# EAGLE design Arturo_Verasv22 (EAGLE 8.7.1)
Circuito Anti-jammer
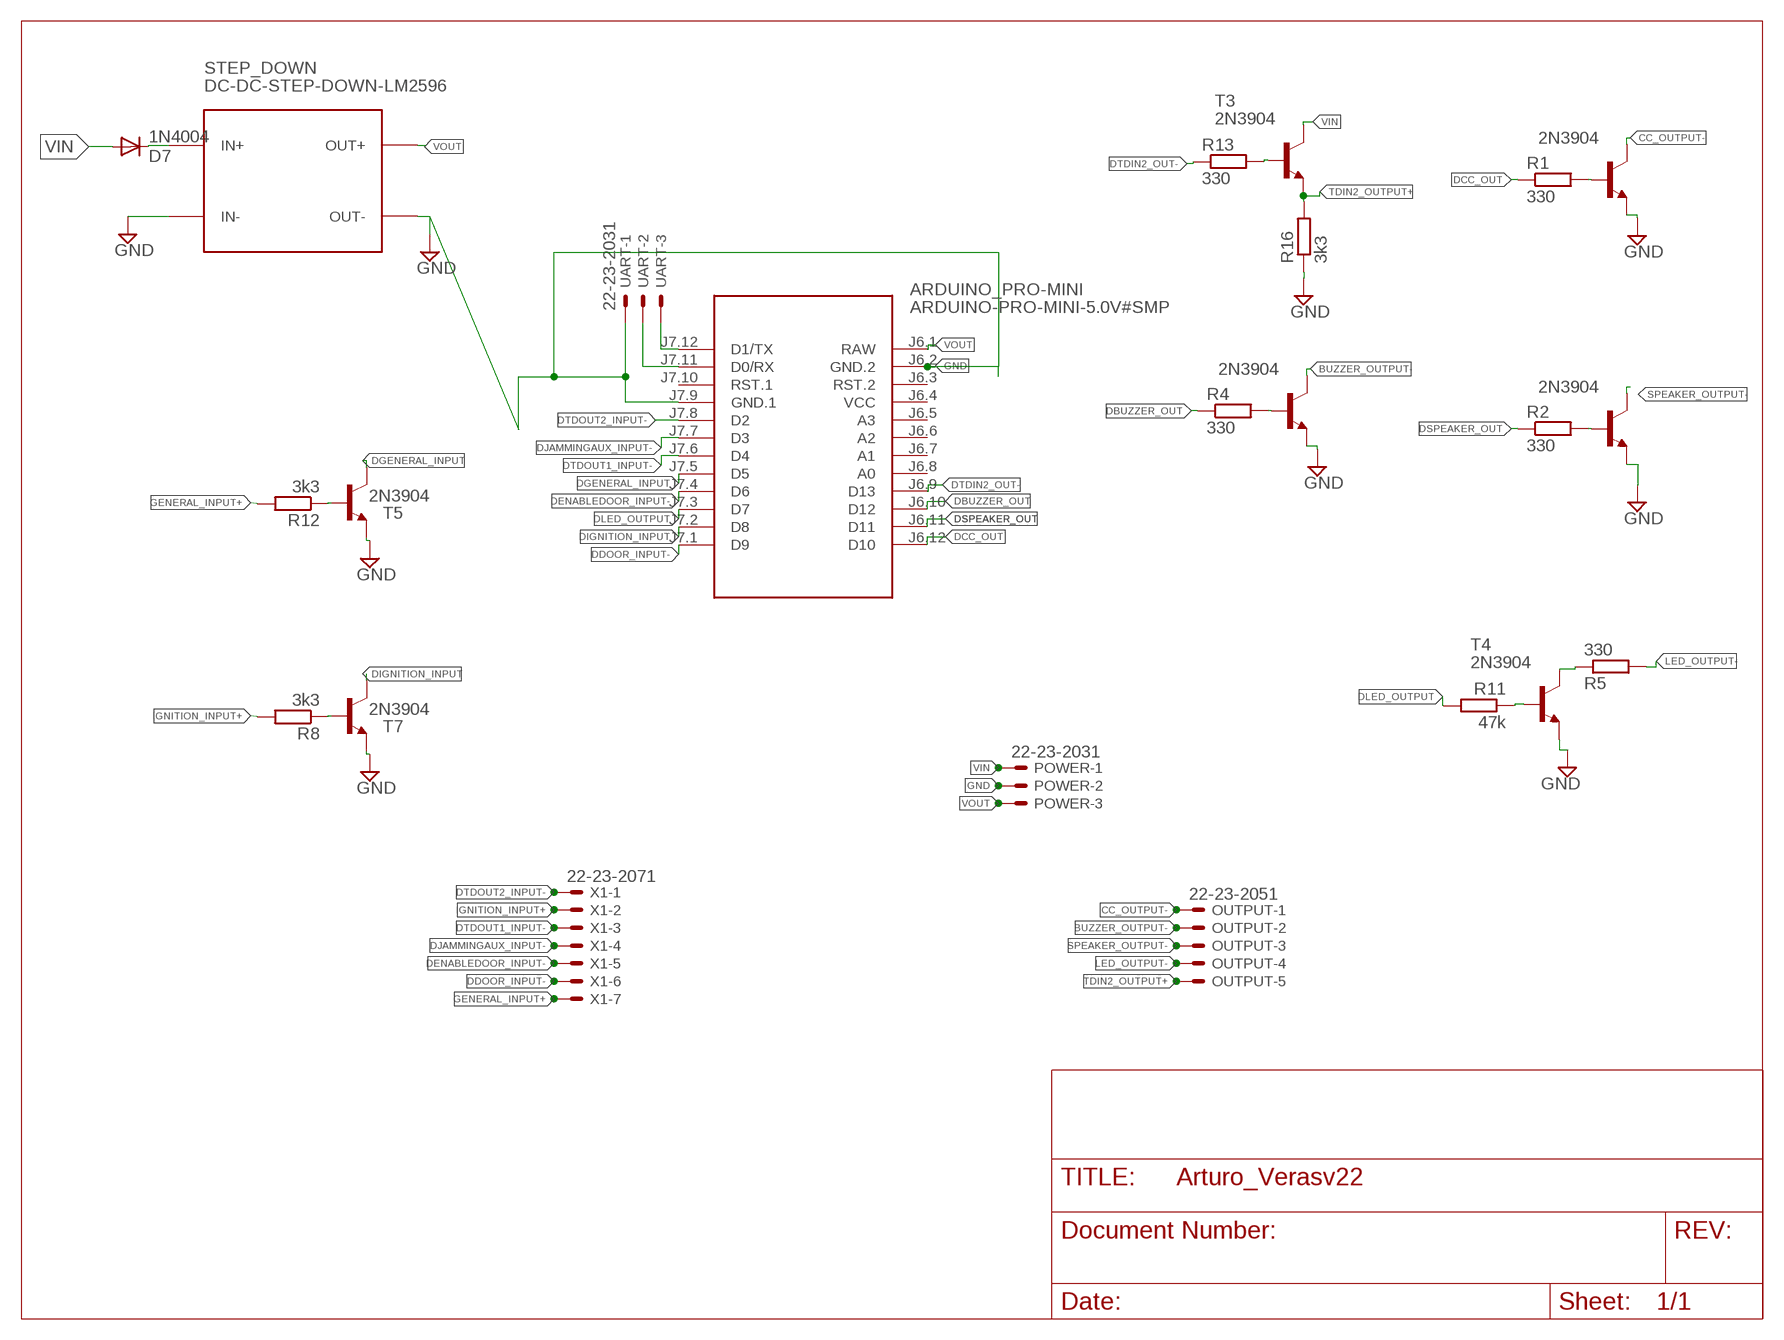
[diagram p0: schematic, sheet 1]

## Parts
ARDUINO_PRO-MINI  ARDUINO-PRO-MINI-5.0V#SMP  [ARDUINO-PRO-MINI#SMP]
D7  1N4004  [DO41-10]
OUTPUT  22-23-2051  [22-23-2051]
POWER  22-23-2031  [22-23-2031]
R1  330  R-EU_0204/7  [0204/7]
R2  330  R-EU_0204/7  [0204/7]
R4  330  R-EU_0204/7  [0204/7]
R5  330  R-EU_0204/7  [0204/7]
R8  3k3  R-EU_0204/7  [0204/7]
R11  47k  R-EU_0204/7  [0204/7]
R12  3k3  R-EU_0204/7  [0204/7]
R13  330  R-EU_0204/7  [0204/7]
R16  3k3  R-EU_0204/7  [0204/7]
STEP_DOWN  DC-DC-STEP-DOWN-LM2596  [DC-DC-STEP-DOWN-LM2596]
T1  2N3904  [TO92]
T3  2N3904  [TO92]
T4  2N3904  [TO92]
T5  2N3904  [TO92]
T6  2N3904  [TO92]
T7  2N3904  [TO92]
T8  2N3904  [TO92]
UART  22-23-2031  [22-23-2031]
X1  22-23-2071  [22-23-2071]

## Nets
BUZZER_OUTPUT-: OUTPUT.2 T6.1(C)
CC_OUTPUT-: OUTPUT.1 T8.1(C)
DBUZZER_OUT: ARDUINO_PRO-MINI.J6.10(D12) R4.1
DCC_OUT: ARDUINO_PRO-MINI.J6.12(D10) R1.1
DDOOR_INPUT-: ARDUINO_PRO-MINI.J7.1(D9) X1.6
DENABLEDOOR_INPUT-: ARDUINO_PRO-MINI.J7.4(D6) X1.5
DGENERAL_INPUT: ARDUINO_PRO-MINI.J7.5(D5) T5.1(C)
DIGNITION_INPUT: ARDUINO_PRO-MINI.J7.2(D8) T7.1(C)
DJAMMINGAUX_INPUT-: ARDUINO_PRO-MINI.J7.7(D3) X1.4
DLED_OUTPUT: ARDUINO_PRO-MINI.J7.3(D7) R11.2
DSPEAKER_OUT: ARDUINO_PRO-MINI.J6.11(D11) R2.1
DTDIN2_OUT-: ARDUINO_PRO-MINI.J6.9(D13) R13.1
DTDOUT1_INPUT-: ARDUINO_PRO-MINI.J7.6(D4) X1.3
DTDOUT2_INPUT-: ARDUINO_PRO-MINI.J7.8(D2) X1.1
GENERAL_INPUT+: R12.2 X1.7
GND: ARDUINO_PRO-MINI.J6.2(GND.2) ARDUINO_PRO-MINI.J7.9(GND.1) POWER.2 R16.1 STEP_DOWN.IN- STEP_DOWN.OUT- T1.3(E) T4.3(E) T5.3(E) T6.3(E) T7.3(E) T8.3(E) UART.1
IGNITION_INPUT+: R8.2 X1.2
LED_OUTPUT-: OUTPUT.4 R5.2
N$1: R12.1 T5.2(B)
N$2: R13.2 T3.2(B)
N$3: R1.2 T8.2(B)
N$4: R2.2 T1.2(B)
N$5: R4.2 T6.2(B)
N$6: R5.1 T4.1(C)
N$7: ARDUINO_PRO-MINI.J7.12(D1/TX) UART.3
N$8: ARDUINO_PRO-MINI.J7.11(D0/RX) UART.2
N$20: R11.1 T4.2(B)
N$22: R8.1 T7.2(B)
N$23: D7.C STEP_DOWN.IN+
SPEAKER_OUTPUT-: OUTPUT.3 T1.1(C)
TDIN2_OUTPUT+: OUTPUT.5 R16.2 T3.3(E)
VIN: D7.A POWER.1 T3.1(C)
VOUT: ARDUINO_PRO-MINI.J6.1(RAW) POWER.3 STEP_DOWN.OUT+
Unconnected: ARDUINO_PRO-MINI.J6.3(RST.2) ARDUINO_PRO-MINI.J6.5(A3) ARDUINO_PRO-MINI.J6.6(A2) ARDUINO_PRO-MINI.J6.7(A1) ARDUINO_PRO-MINI.J6.8(A0) ARDUINO_PRO-MINI.J7.10(RST.1)

## Power pins joined to a net without a drawn wire
VOUT: ARDUINO_PRO-MINI.J6.4(VCC)

## Library data of the parts
ARDUINO_PRO-MINI = diy-modules:ARDUINO-PRO-MINI-*#SMP: Arduino Pro Mini (and compatible devices) with 2 connectors only More details available here: https://www.arduino.cc/en/Main/ArduinoBoardProMini Click here to find device on ebay.com <http://www.ebay.com/sch/arduino+pro+mini>
D7 = diode:1N4004: DIODE general purpose rectifier, 1 A
OUTPUT = con-molex:22-23-2051: .100" (2.54mm) Center Header - 5 Pin; MF: MOLEX; MPN: 22-23-2051; OC_FARNELL: 1462952; OC_NEWARK: 38C9178
POWER UART = con-molex:22-23-2031: .100" (2.54mm) Center Header - 3 Pin; MF: MOLEX; MPN: 22-23-2031; OC_FARNELL: 1462950; OC_NEWARK: 30C0862
R1 R2 R4 R5 R8 R11-R13 R16 = resistor:R-EU_: RESISTOR, European symbol
STEP_DOWN = diy-modules:DC-DC-STEP-DOWN-LM2596: DC/DC Step-Down Regulator based on LM2596-ADJ chip LM2596 datasheet available here: http://www.ti.com/lit/ds/symlink/lm2596.pdf Click here to find device on ebay.com <http://www.ebay.com/sch/lm2596+power+regulator>
T1 T3-T8 = transistor:2N3904: NPN TRANSISTOR
X1 = con-molex:22-23-2071: .100" (2.54mm) Center Header - 7 Pin; MF: MOLEX; MPN: 22-23-2071; OC_FARNELL: 1654534; OC_NEWARK: 56H0445

## Board
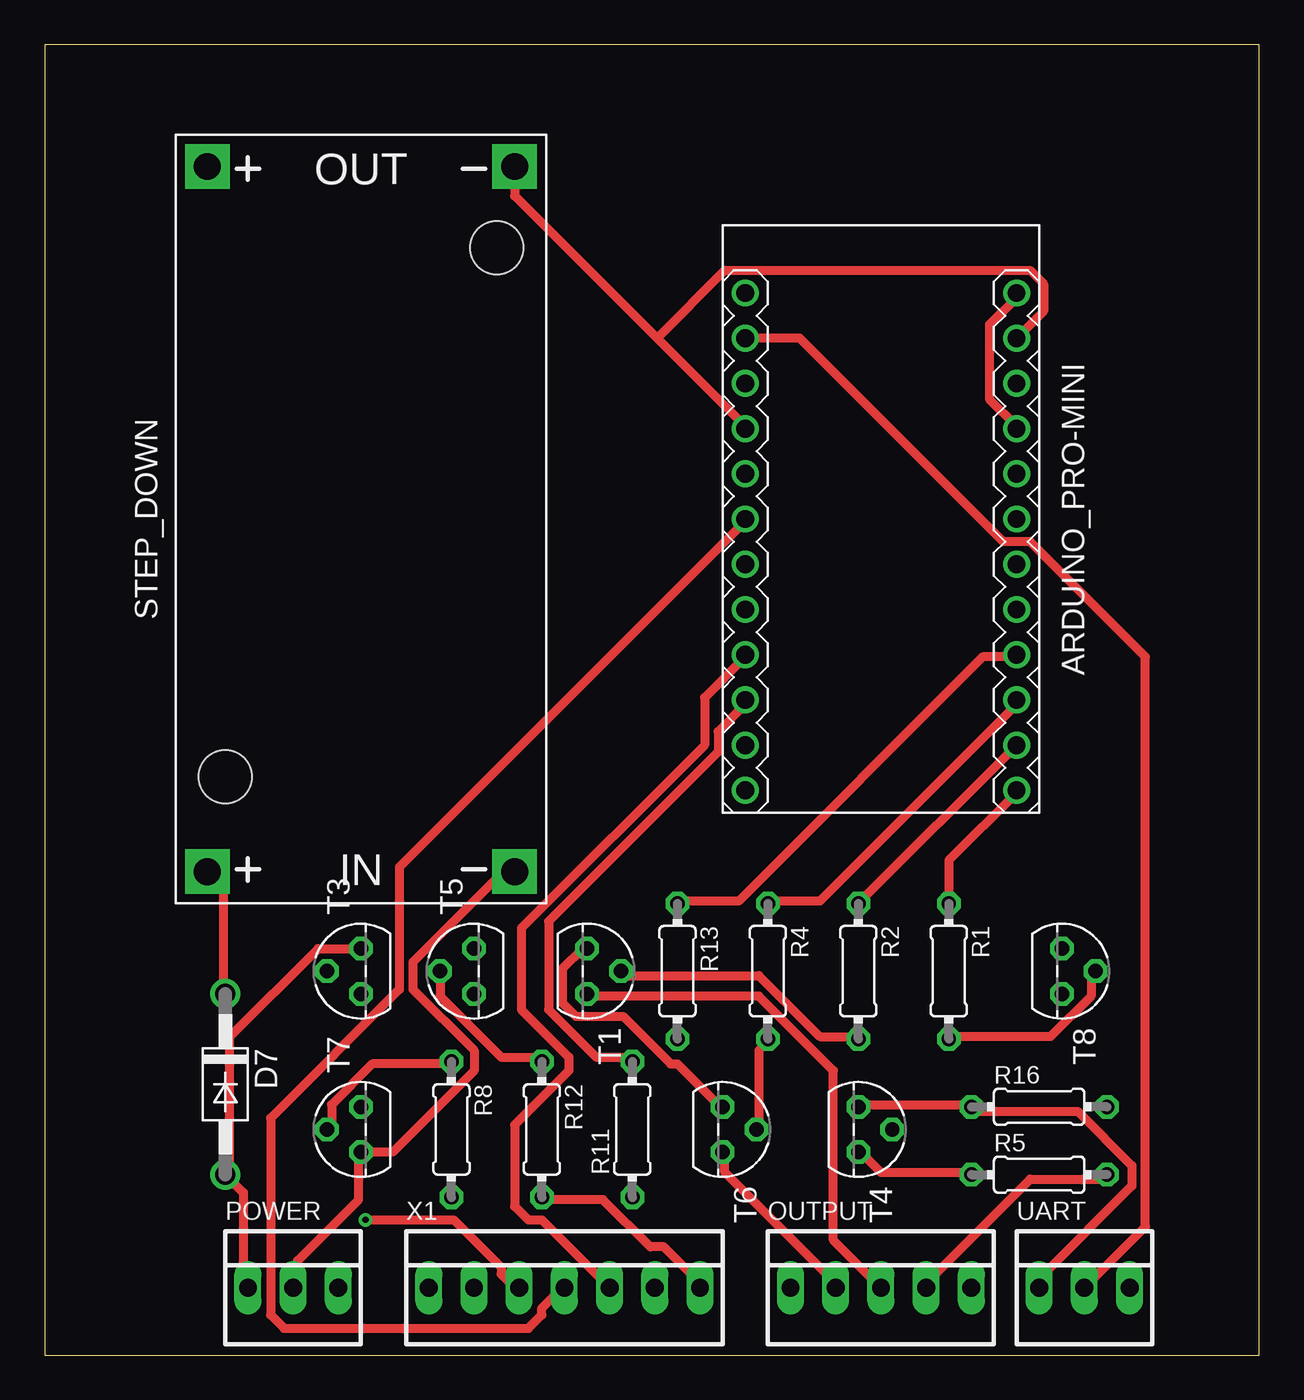
[diagram p1: board, top side]
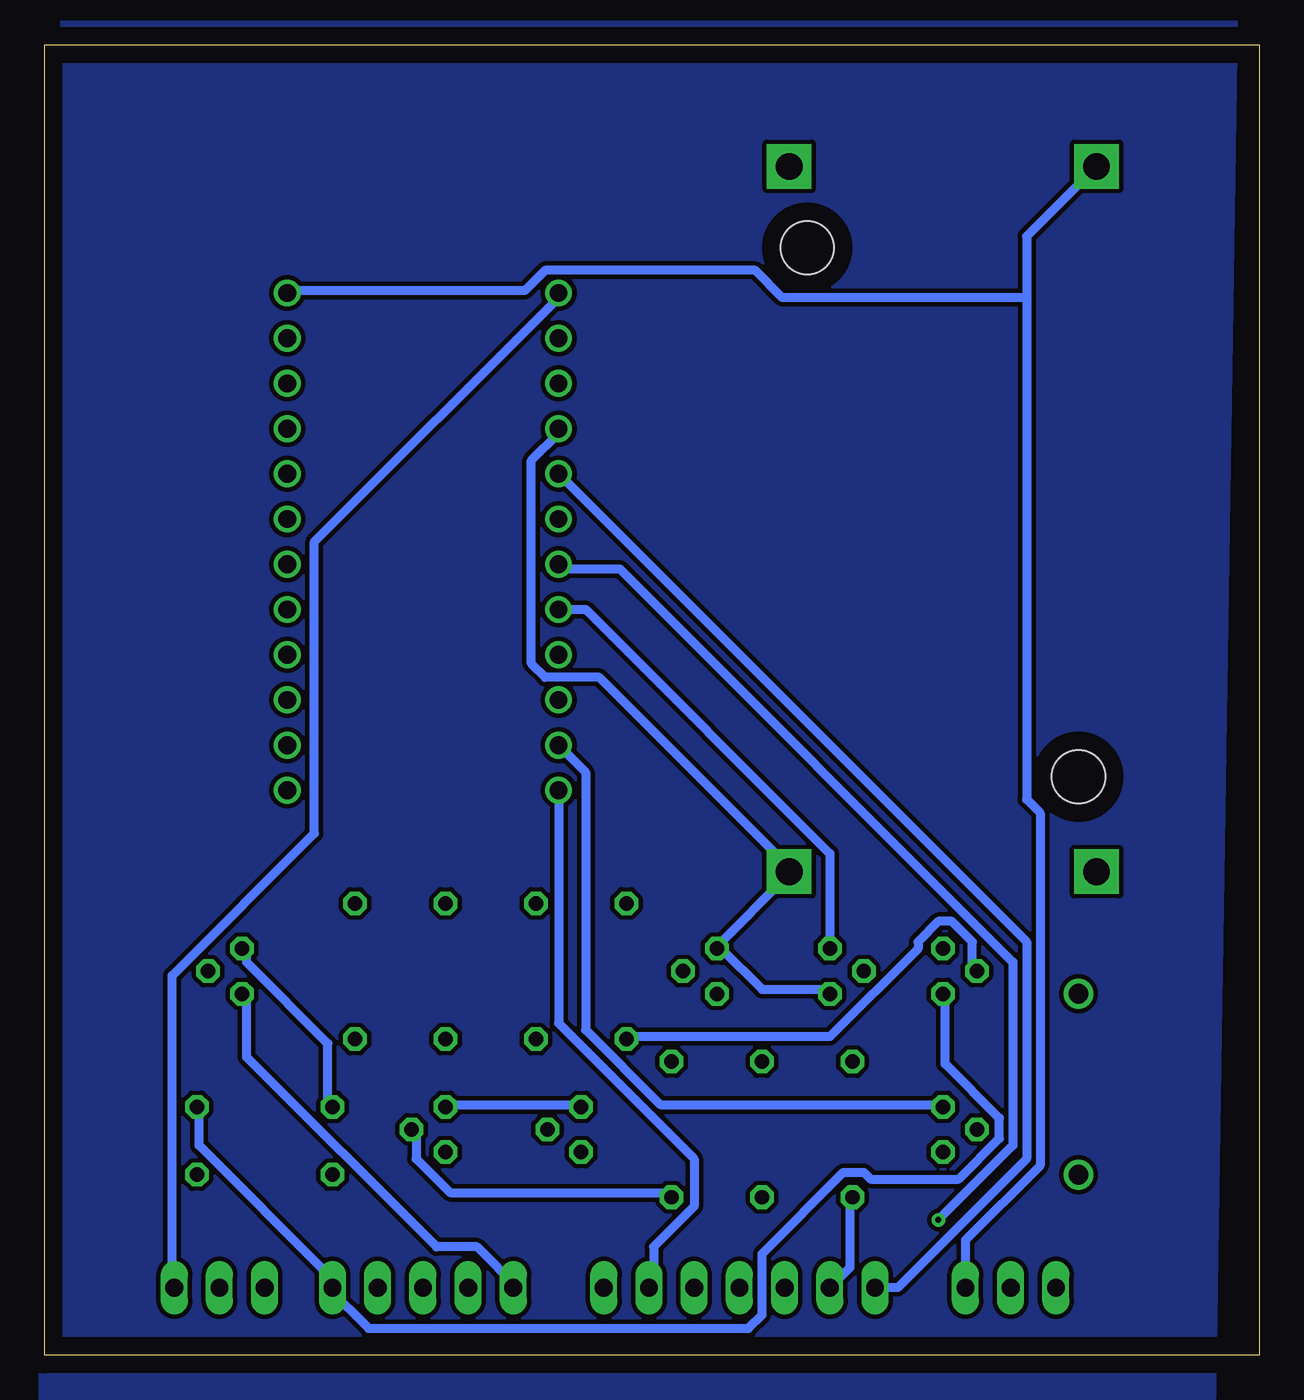
[diagram p2: board, bottom side, seen from below]

Size 68.25 x 73.65 mm. Coordinates in mm from the lower left corner, seen from the top.
Outline: 0,0 68.25,0 68.25,73.65 0,73.65 0,0
Copper layers (1*16): Top 0.035mm / dielectric 1.5mm / Bottom 0.035mm
Design rules "default *": minimum track width 20mil, minimum drill 0.35mm, track to track 10mil, track to pad 10mil, pad to pad 6mil, via to via 10mil, smd to smd 6mil, copper to edge 40mil, drill to drill 6mil, minimum pad ring 10mil, minimum via ring 8mil, stop-mask expansion 4mil, vias tented up to drill 0mil, thermal gap 10mil

### Footprints (pad centres in the part's own frame; a part is rotated, then mirrored left to right if it is on the bottom)
ARDUINO-PRO-MINI#SMP = drill 1: J6.1 -12.7,7.62; J6.2 -10.16,7.62; J6.3 -7.62,7.62; J6.4 -5.08,7.62; J6.5 -2.54,7.62; J6.6 0,7.62; J6.7 2.54,7.62; J6.8 5.08,7.62; J6.9 7.62,7.62; J6.10 10.16,7.62; J6.11 12.7,7.62; J6.12 15.24,7.62; J7.1 15.24,-7.62; J7.2 12.7,-7.62; J7.3 10.16,-7.62; J7.4 7.62,-7.62; J7.5 5.08,-7.62; J7.6 2.54,-7.62; J7.7 0,-7.62; J7.8 -2.54,-7.62; J7.9 -5.08,-7.62; J7.10 -7.62,-7.62; J7.11 -10.16,-7.62; J7.12 -12.7,-7.62
DO41-10 = drill 1.118: A 5.08,0; C -5.08,0
22-23-2051 = drill 1 long: 1 -5.08,0; 2 -2.54,0; 3 0,0; 4 2.54,0; 5 5.08,0
22-23-2031 = drill 1 long: 1 -2.54,0; 2 0,0; 3 2.54,0
0204/7 = drill 0.813 octagon: 1 -3.81,0; 2 3.81,0
DC-DC-STEP-DOWN-LM2596 = drill 1.5 pad 2.5 square: IN+ -19.812,8.636; IN- -19.812,-8.636; OUT+ 19.812,8.636; OUT- 19.812,-8.636 | hole 3: -14.478,7.62; 15.24,-7.62
TO92 = drill 0.813 octagon: 1 1.27,0; 2 0,1.905; 3 -1.27,0
22-23-2071 = drill 1 long: 1 -7.62,0; 2 -5.08,0; 3 -2.54,0; 4 0,0; 5 2.54,0; 6 5.08,0; 7 7.62,0

### Placement (x,y rotation side)
ARDUINO_PRO-MINI  46.99,46.99 270 top
D7  10.16,15.24 270 top
OUTPUT  46.99,3.81 0 top
POWER  13.97,3.81 0 top
R1  50.8,21.59 270 top
R2  45.72,21.59 270 top
R4  40.64,21.59 270 top
R5  55.88,10.16 0 top
R8  22.86,12.7 270 top
R11  33.02,12.7 90 top
R12  27.94,12.7 270 top
R13  35.56,21.59 270 top
R16  55.88,13.97 0 top
STEP_DOWN  17.78,46.99 90 top
T1  30.48,21.59 270 top
T3  17.78,21.59 90 top
T4  45.72,12.7 270 top
T5  24.13,21.59 90 top
T6  38.1,12.7 270 top
T7  17.78,12.7 90 top
T8  57.15,21.59 270 top
UART  58.42,3.81 0 top
X1  29.21,3.81 0 top

### Tracks (layer width: path | path; a pad name or v marks a point on that pad's centre or on a via)
BUZZER_OUTPUT-
  Top 0.508: T6.1 38.23,11.43 38.23,10.29 44.7,3.81 OUTPUT.2
CC_OUTPUT-
  Bottom 0.508: T8.1 56.9,20.19 56.9,16.76 46.23,6.1 43.94,6.1 41.66,3.81 OUTPUT.1
DBUZZER_OUT
  Top 0.508: R4.1 40.89,25.53 43.56,25.53 54.61,36.58 ARDUINO_PRO-MINI.J6.10
DCC_OUT
  Top 0.508: R1.1 50.8,27.81 54.61,31.62 ARDUINO_PRO-MINI.J6.12
DDOOR_INPUT-
  Bottom 0.508: ARDUINO_PRO-MINI.J7.1 39.37,18.67 31.75,11.05 31.75,8.38 34.04,6.1 34.04,3.81 X1.6
DENABLEDOOR_INPUT-
  Top 0.508: X1.5 27.94,7.62 27.18,7.62 26.42,8.38 26.42,12.95 29.46,16 29.46,16.76 26.8,19.43 26.8,24 37.08,34.29 37.08,36.96 39.37,39.24 ARDUINO_PRO-MINI.J7.4
DGENERAL_INPUT
  Bottom 0.508: T5.1 24.13,28.19 37.85,41.91 ARDUINO_PRO-MINI.J7.5
DIGNITION_INPUT
  Bottom 0.508: ARDUINO_PRO-MINI.J7.2 37.85,32.77 37.85,18.29 33.66,14.1 18.03,14.1 T7.1
DJAMMINGAUX_INPUT-
  Top 0.508: X1.4 29.08,3.81 27.94,2.67 27.94,2.29 27.18,1.52 13.46,1.52 12.7,2.29 12.7,13.34 19.94,20.57 19.94,27.43 39.37,46.86 ARDUINO_PRO-MINI.J7.7
DLED_OUTPUT
  Top 0.508: R11.2 32.89,16.76 30.99,16.76 28.32,19.43 28.32,24.38 37.85,33.91 37.85,35.05 39.37,36.58 ARDUINO_PRO-MINI.J7.3
DSPEAKER_OUT
  Top 0.508: ARDUINO_PRO-MINI.J6.11 R2.1
DTDIN2_OUT-
  Top 0.508: R13.1 35.56,25.53 38.99,25.53 52.7,39.24 54.61,39.24 ARDUINO_PRO-MINI.J6.9
DTDOUT1_INPUT-  (via drill 0.35)
  Top 0.508: v18.03,7.62 22.99,7.62 25.65,4.95 25.65,4.57 26.42,3.81 X1.3
  Bottom 0.508: v18.03,7.62 13.84,11.81 13.84,22.1 35.94,44.2 39.37,44.2 ARDUINO_PRO-MINI.J7.6
DTDOUT2_INPUT-
  Bottom 0.508: X1.1 20.32,3.81 13.08,11.05 13.08,23.24 ARDUINO_PRO-MINI.J7.8
GENERAL_INPUT+
  Top 0.508: R12.2 27.94,8.76 31.37,8.76 34.04,6.1 34.8,6.1 37.08,3.81 X1.7
GND
  Top 0.508: 34.42,57.15 26.42,65.15 STEP_DOWN.OUT- | 34.42,57.15 39.37,52.2 ARDUINO_PRO-MINI.J7.9 | ARDUINO_PRO-MINI.J6.2 56.13,58.67 56.13,60.2 55.37,60.96 38.23,60.96 34.42,57.15 | T4.3 45.85,14.1 51.94,14.1 R16.1 52.32,13.72 58.04,13.72 61.09,10.67 61.09,9.53 56.13,4.57 56.13,3.81 UART.1 | POWER.2 14.22,3.81 14.22,5.33 17.65,8.76 17.65,11.43 T7.3 19.56,11.43 24.13,16 24.13,17.14 20.7,20.57 20.7,22.1 25.65,27.05 26.42,27.05 STEP_DOWN.IN- | T6.3 37.85,14.1 35.56,16.38 35.18,16.38 32.51,19.05 29.84,19.05 29.08,19.81 29.08,21.72 30.23,22.86 T1.3
  Bottom 0.508: T6.3 38.23,14.1 45.47,14.1 T4.3 | T8.3 56.9,22.86 56.9,22.1 52.32,17.53 52.32,14.1 R16.1 | T5.3 24.13,20.57 27.94,20.57 30.23,22.86 T1.3 30.61,22.86 26.42,27.05 STEP_DOWN.IN- 26.42,27.43 37.08,38.1 40.13,38.1 40.89,38.86 40.89,50.29 39.37,51.82 ARDUINO_PRO-MINI.J7.9
IGNITION_INPUT+
  Bottom 0.508: X1.2 22.99,4.95 22.99,8.76 R8.2
LED_OUTPUT-
  Top 0.508: R5.2 59.56,9.91 55.37,9.91 49.28,3.81 OUTPUT.4
N$1
  Top 0.508: T5.2 22.23,20.19 25.65,16.76 27.94,16.76 R12.1
N$2
  Bottom 0.508: R13.2 35.56,17.91 24.13,17.91 19.18,22.86 19.18,23.24 18.03,24.38 17.27,24.38 16.13,23.24 16.13,21.72 T3.2
N$3
  Top 0.508: R1.2 50.8,17.91 56.52,17.91 58.8,20.19 58.8,21.34 T8.2
N$4
  Top 0.508: R2.2 45.47,17.91 43.56,17.91 40.13,21.34 32.51,21.34 T1.2
N$5
  Top 0.508: T6.2 40.13,12.95 40.13,17.14 40.51,17.53 R4.2
N$6
  Top 0.508: R5.1 51.94,10.29 46.99,10.29 45.85,11.43 T4.1
N$7
  Bottom 0.508: ARDUINO_PRO-MINI.J7.12 39.37,59.44 53.09,45.72 53.09,29.34 61.09,21.34 61.09,3.81 UART.3
N$8
  Top 0.508: ARDUINO_PRO-MINI.J7.11 42.42,57.15 53.85,45.72 55.37,45.72 61.85,39.24 61.85,7.24 UART.2
N$9
  pour Bottom: 1.27,74.93 67.31,74.93 68.58,-5.08 2.54,-5.08
N$20
  Bottom 0.508: R11.1 33.27,9.14 45.47,9.14 47.37,11.05 47.37,12.57 T4.2
N$22
  Top 0.508: T7.2 16.13,12.95 16.13,14.1 18.41,16.38 22.61,16.38 R8.1
N$23
  Top 0.508: STEP_DOWN.IN+ 10.03,26.29 10.03,20.57 D7.C
SPEAKER_OUTPUT-
  Top 0.508: OUTPUT.3 44.32,6.48 44.32,16 40.13,20.19 30.61,20.19 T1.1
TDIN2_OUTPUT+
  Bottom 0.508: 52.32,3.81 52.32,4.57 59.56,11.81 59.56,13.72 R16.2 | 52.32,3.81 50.04,1.52 28.7,1.52 27.94,2.29 27.94,5.71 23.37,10.29 22.23,10.29 21.84,9.91 16.89,9.91 14.61,12.19 14.61,13.34 17.65,16.38 17.65,20.19 T3.3 | 52.32,3.81 OUTPUT.5
VIN
  Top 0.508: T3.1 15.37,22.86 10.41,17.91 10.41,10.29 D7.A 11.18,9.14 11.18,3.81 POWER.1
VOUT
  Top 0.508: ARDUINO_PRO-MINI.J6.4 54.61,52.2 53.09,53.72 53.09,57.91 54.61,59.44 ARDUINO_PRO-MINI.J6.1
  Bottom 0.508: POWER.3 16.51,6.48 12.32,10.67 12.32,30.48 13.08,31.24 13.08,59.44 | 13.08,59.44 13.08,62.87 STEP_DOWN.OUT+ | 13.08,59.44 26.8,59.44 28.32,60.96 40.13,60.96 41.27,59.82 54.61,59.82 ARDUINO_PRO-MINI.J6.1